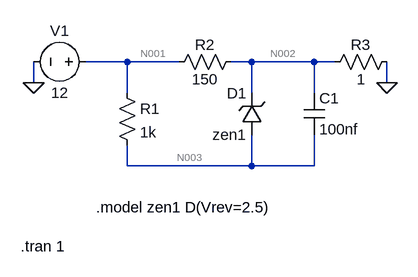
[diagram p0: schematic Draft1.asc]
Draft1.asc, the LTspice schematic file:
Version 4
SHEET 1 880 680
WIRE 128 48 64 48
WIRE 208 48 128 48
WIRE 320 48 288 48
WIRE 416 48 320 48
WIRE 448 48 416 48
WIRE -16 80 -16 48
WIRE 528 80 528 48
WIRE 128 96 128 48
WIRE 320 96 320 48
WIRE 416 96 416 48
WIRE 128 208 128 176
WIRE 320 208 320 160
WIRE 320 208 128 208
WIRE 416 208 416 160
WIRE 416 208 320 208
FLAG -16 80 0
FLAG 528 80 0
SYMBOL res 112 80 R0
SYMATTR InstName R1
SYMATTR Value 1k
SYMBOL res 304 32 R90
WINDOW 0 5 56 VBottom 2
WINDOW 3 27 56 VTop 2
SYMATTR InstName R2
SYMATTR Value 150
SYMBOL cap 400 96 R0
SYMATTR InstName C1
SYMATTR Value 100nf
SYMBOL zener 336 160 R180
WINDOW 0 24 64 Left 2
WINDOW 3 24 0 Left 2
SYMATTR InstName D1
SYMATTR Value zen1
SYMBOL voltage 80 48 R90
WINDOW 0 -32 56 VBottom 2
WINDOW 3 32 56 VTop 2
WINDOW 123 0 0 Left 0
WINDOW 39 0 0 Left 0
SYMATTR InstName V1
SYMATTR Value 12
SYMBOL res 544 32 R90
WINDOW 0 5 56 VBottom 2
WINDOW 3 27 56 VTop 2
SYMATTR InstName R3
SYMATTR Value 1
TEXT 80 272 Left 2 !.model zen1 D(Vrev=2.5)
TEXT -36 332 Left 2 !.tran 1

The netlist it stands for:
* Draft1.asc
R1 N001 N003 1k
R2 N002 N001 150
C1 N002 N003 100nf
D1 N003 N002 zen1
V1 N001 0 12
R3 0 N002 1
.model D D
.lib standard.dio
.model zen1 D(Vrev=2.5)
.tran 1
.backanno
.end

* Results of the author's LTspice run, read from the files saved beside the schematic
* Operating Point, zero values left out:
*   V(n001) = 12 V
*   V(n003) = 91.31 mV
*   V(n002) = 91.3 mV
*   I(D1) = 11.91 mA
*   I(R3) = -91.3 mA
*   I(R2) = -79.39 mA
*   I(R1) = 11.91 mA
*   I(V1) = -91.3 mA